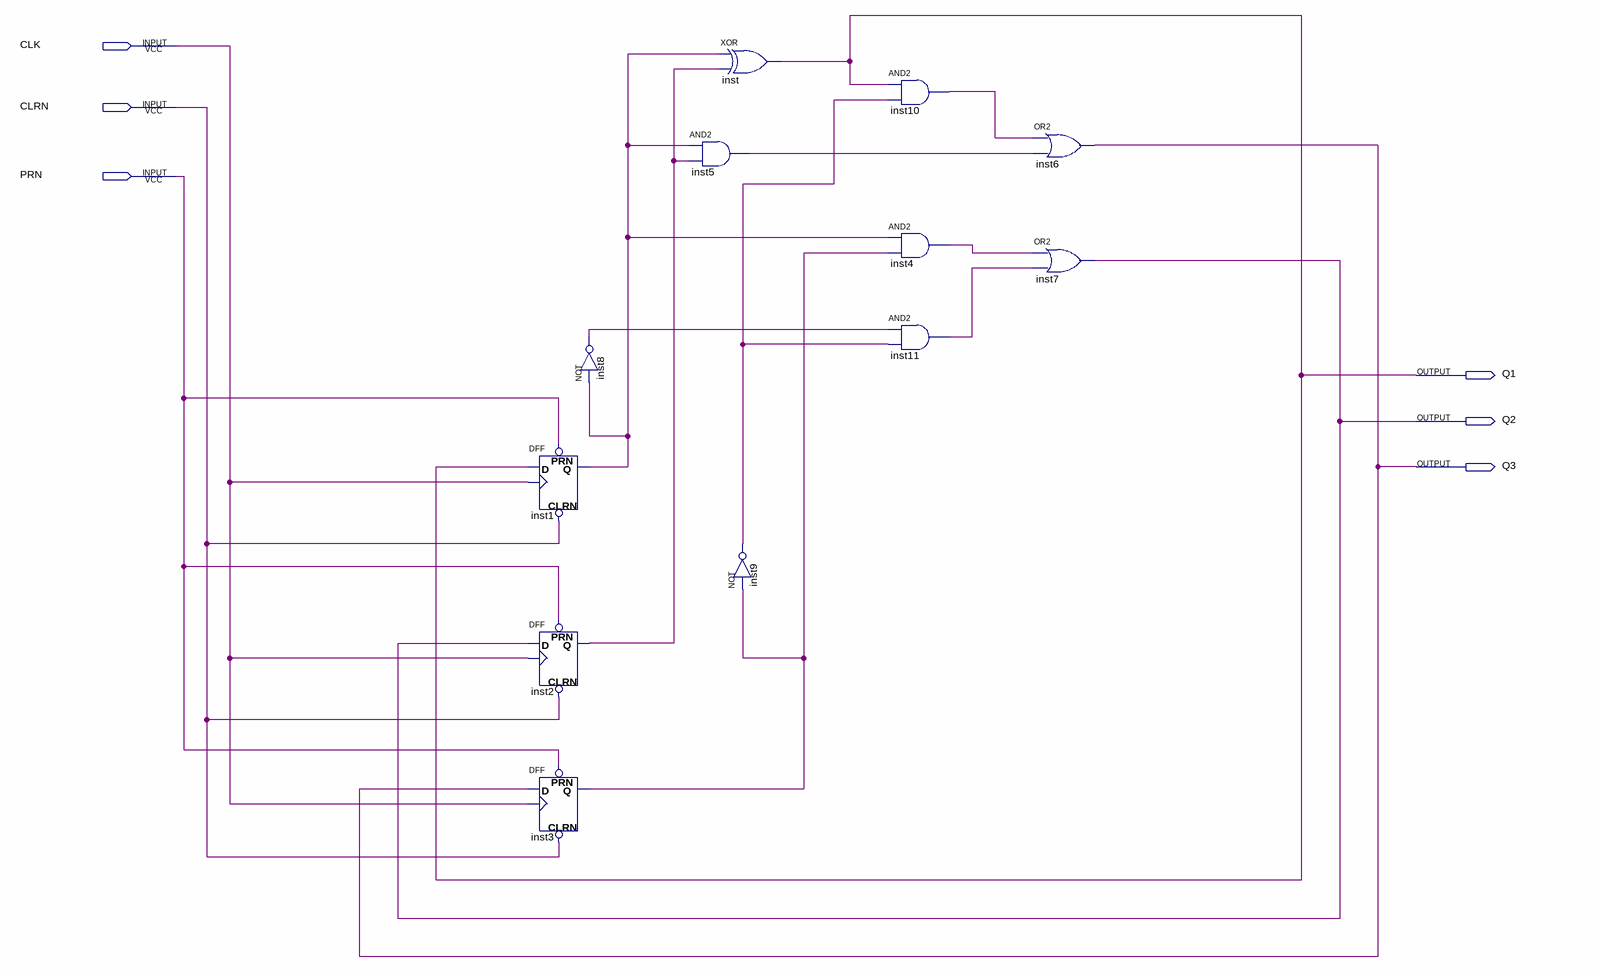
[diagram p0: schematic sheet]
// Quartus schematic Count.bdf as structural Verilog: 12 symbols, 6 pins
module Count (
  input  CLK,
  input  CLRN,
  input  PRN,
  output Q1,
  output Q2,
  output Q3
);

  wire inst1_q, inst2_q, inst3_q, inst4_out, inst5_out, inst8_out, inst9_out, inst10_out, inst11_out;

  not inst8 (inst8_out, inst1_q);
  DFF inst1 (.CLRN(CLRN), .CLK(CLK), .D(Q1), .PRN(PRN), .Q(inst1_q));
  DFF inst2 (.CLRN(CLRN), .CLK(CLK), .D(Q2), .PRN(PRN), .Q(inst2_q));
  DFF inst3 (.CLRN(CLRN), .CLK(CLK), .D(Q3), .PRN(PRN), .Q(inst3_q));
  and inst5 (inst5_out, inst1_q, inst2_q);
  xor inst (Q1, inst1_q, inst2_q);
  not inst9 (inst9_out, inst3_q);
  and inst10 (inst10_out, Q1, inst9_out);
  and inst4 (inst4_out, inst1_q, inst3_q);
  and inst11 (inst11_out, inst8_out, inst9_out);
  or inst6 (Q3, inst10_out, inst5_out);
  or inst7 (Q2, inst4_out, inst11_out);
endmodule
